# EAGLE design Example_Project (EAGLE 9.6.2)
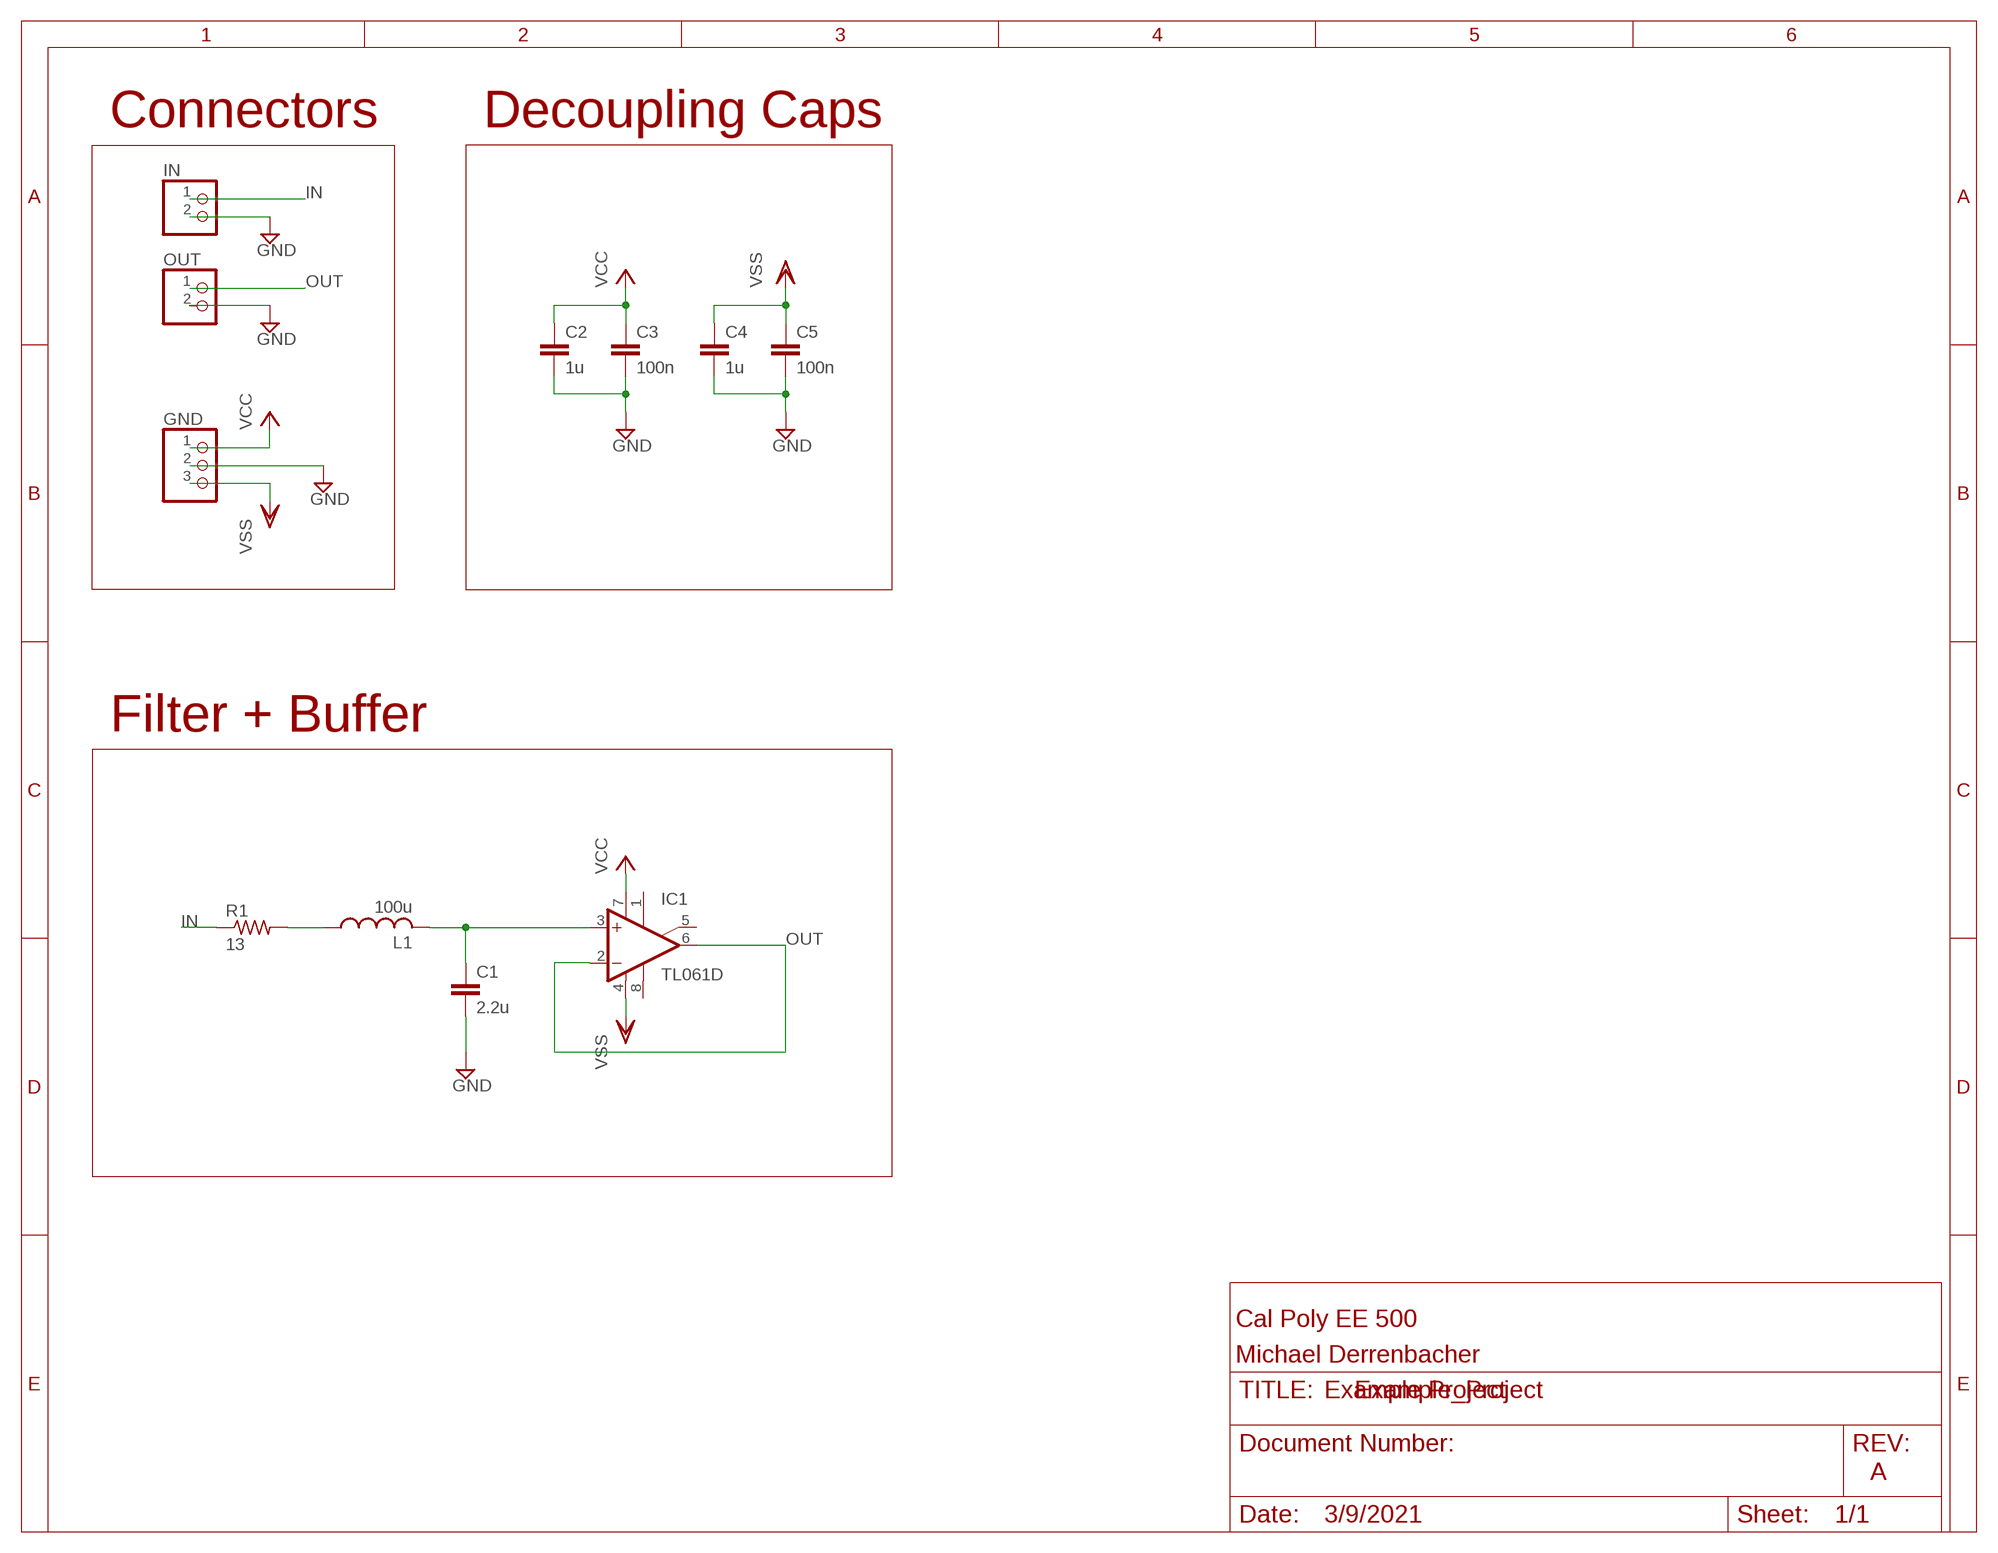
[diagram p0: schematic, sheet 1]

## Parts
C1  2.2u  C-EUC0805  [C0805]
C2  1u  C-EUC0805  [C0805]
C3  100n  C-EUC0805  [C0805]
C4  1u  C-EUC0805  [C0805]
C5  100n  C-EUC0805  [C0805]
GND  PINHD-1X3  [1X03]
IC1  TL061D  [SO08]
IN  PINHD-1X2  [1X02]
L1  100u  L-USL1812  [L1812]
OUT  PINHD-1X2  [1X02]
R1  13  R-US_R0805  [R0805]

## Nets
GND: C1.2 C2.2 C3.2 C4.2 C5.2 GND.2 IN.2 OUT.2
IN: IN.1 R1.1
N$2: L1.1 R1.2
N$3: C1.1 IC1.3(+IN) L1.2
OUT: IC1.2(-IN) IC1.6(OUT) OUT.1
VCC: C2.1 C3.1 GND.1 IC1.7(V+)
VSS: C4.1 C5.1 GND.3 IC1.4(V-)
Unconnected: IC1.1(ON1) IC1.5(ON2) IC1.8(OPT)

## Notes on the sheet
- Connectors | Decoupling Caps
- Filter + Buffer
- Cal Poly EE 500
- Michael Derrenbacher
- Example Project
- A
- 3/9/2021

## Library data of the parts
C1-C5 = rcl:C-EU: CAPACITOR, European symbol; SPICEPREFIX: C
GND = pinhead:PINHD-1X3: PIN HEADER
IC1 = linear:TL061: OP AMP
IN OUT = pinhead:PINHD-1X2: PIN HEADER
L1 = rcl:L-US: INDUCTOR, American symbol; SPICEPREFIX: L
R1 = rcl:R-US_: RESISTOR, American symbol; SPICEPREFIX: R

## Board
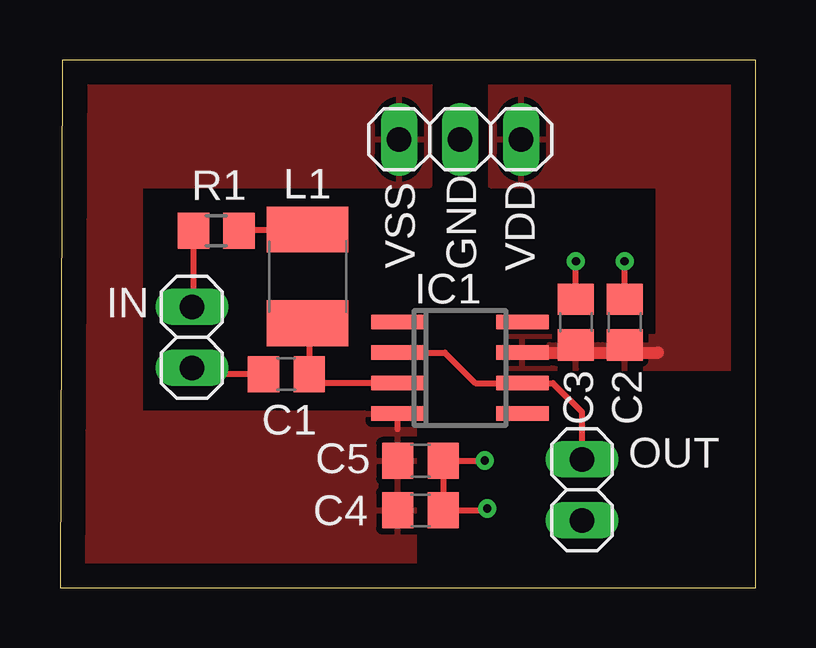
[diagram p1: board, top side]
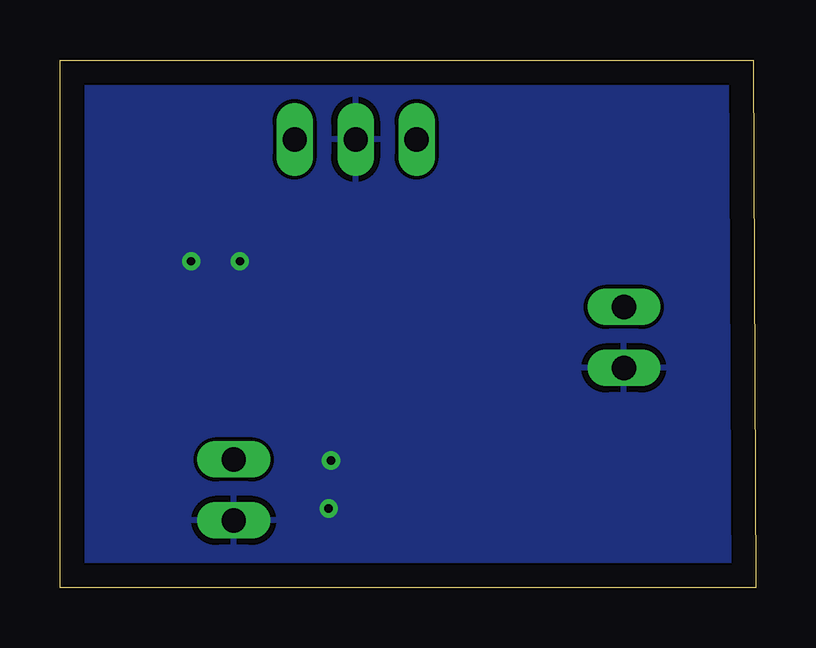
[diagram p2: board, bottom side, seen from below]

Size 28.99 x 21.99 mm. Coordinates in mm from the lower left corner, seen from the top.
Outline: 0,0 28.99,0 28.99,21.99 0.1,21.99 0,0
Copper layers (1*16): Top 0.035mm / dielectric 1.5mm / Bottom 0.035mm
Design rules "default": minimum track width 6mil, minimum drill 0.35mm, track to track 6mil, track to pad 6mil, pad to pad 6mil, via to via 6mil, smd to smd 6mil, copper to edge 40mil, drill to drill 6mil, minimum pad ring 10mil, minimum via ring 8mil, stop-mask expansion 4mil, vias tented up to drill 0mil, thermal gap 10mil

### Footprints (pad centres in the part's own frame; a part is rotated, then mirrored left to right if it is on the bottom)
C0805 = smd 1.3 x 1.5: 1 -0.95,0; 2 0.95,0
1X03 = drill 1.016 long: 1 -2.54,0; 2 0,0; 3 2.54,0
SO08 = smd 0.6 x 2.2: 1 -1.905,-2.6; 2 -0.635,-2.6; 3 0.635,-2.6; 4 1.905,-2.6; 5 1.905,2.6; 6 0.635,2.6; 7 -0.635,2.6; 8 -1.905,2.6
1X02 = drill 1.016 long: 1 -1.27,0; 2 1.27,0
L1812 = smd 1.9 x 3.4: 1 -1.95,0; 2 1.95,0
R0805 = smd 1.3 x 1.5: 1 -0.95,0; 2 0.95,0

### Placement (x,y rotation side)
C1  9.43,8.91 180 top
C2  23.53,11.06 90 top
C3  21.5,11.06 90 top
C4  15.02,3.22 0 top
C5  15.02,5.29 0 top
GND  16.67,18.68 180 top
IC1  16.67,9.16 270 top
IN  5.49,10.43 270 top
L1  10.32,12.97 270 top
OUT  21.75,4.08 270 top
R1  6.51,14.88 0 top

### Tracks (layer width: path | path; a pad name or v marks a point on that pad's centre or on a via)
GND  (via drill 0.35)
  Top 0.254: 15.97,3.79 C4.2 | C4.2 C5.2 v17.69,5.29 v17.7,5.3 | C3.2 v21.5,13.61 | C2.2 v23.53,13.61 | C1.2 5.75,8.91 IN.2 | C4.2 17.72,3.22 v17.8,3.3
  pour Bottom: 1.07,20.93 1.07,0.97 28.17,0.97 28.17,20.93
IN
  Top 0.254: R1.1 5.56,11.77 IN.1
N$2
  Top 0.254: R1.2 7.5,14.92 L1.1
N$3
  Top 0.254: L1.2 10.38,10.96 C1.1 10.76,8.53 IC1.3
OUT
  Top 0.254: OUT.1 21.75,7.32 20.54,8.53 IC1.6 17.3,8.53 16.04,9.79 IC1.2
VCC
  Top 0.254: 21.18,9.79 C3.1
  Top 0.508: IC1.7 24.93,9.79
  pour Top: 17.94,20.93 17.94,16.78 24.93,16.78 24.93,10.43 18.57,10.43 18.57,9.16 28.1,9.16 arc1 28.1,20.93
VSS
  Top 0.254: C4.1 14.19,3.1 | 14.07,6.62 IC1.4
  Top 0.635: 14.13,5.35 C5.1
  pour Top: 15.4,16.78 15.4,20.93 1.06,20.93 1.06,0.94 14.77,0.94 14.77,7.25 3.33,7.25 3.33,16.78

### Text on the board
tPlace: VSS | VDD